# Altium project Chip_Tester.PrjPcb
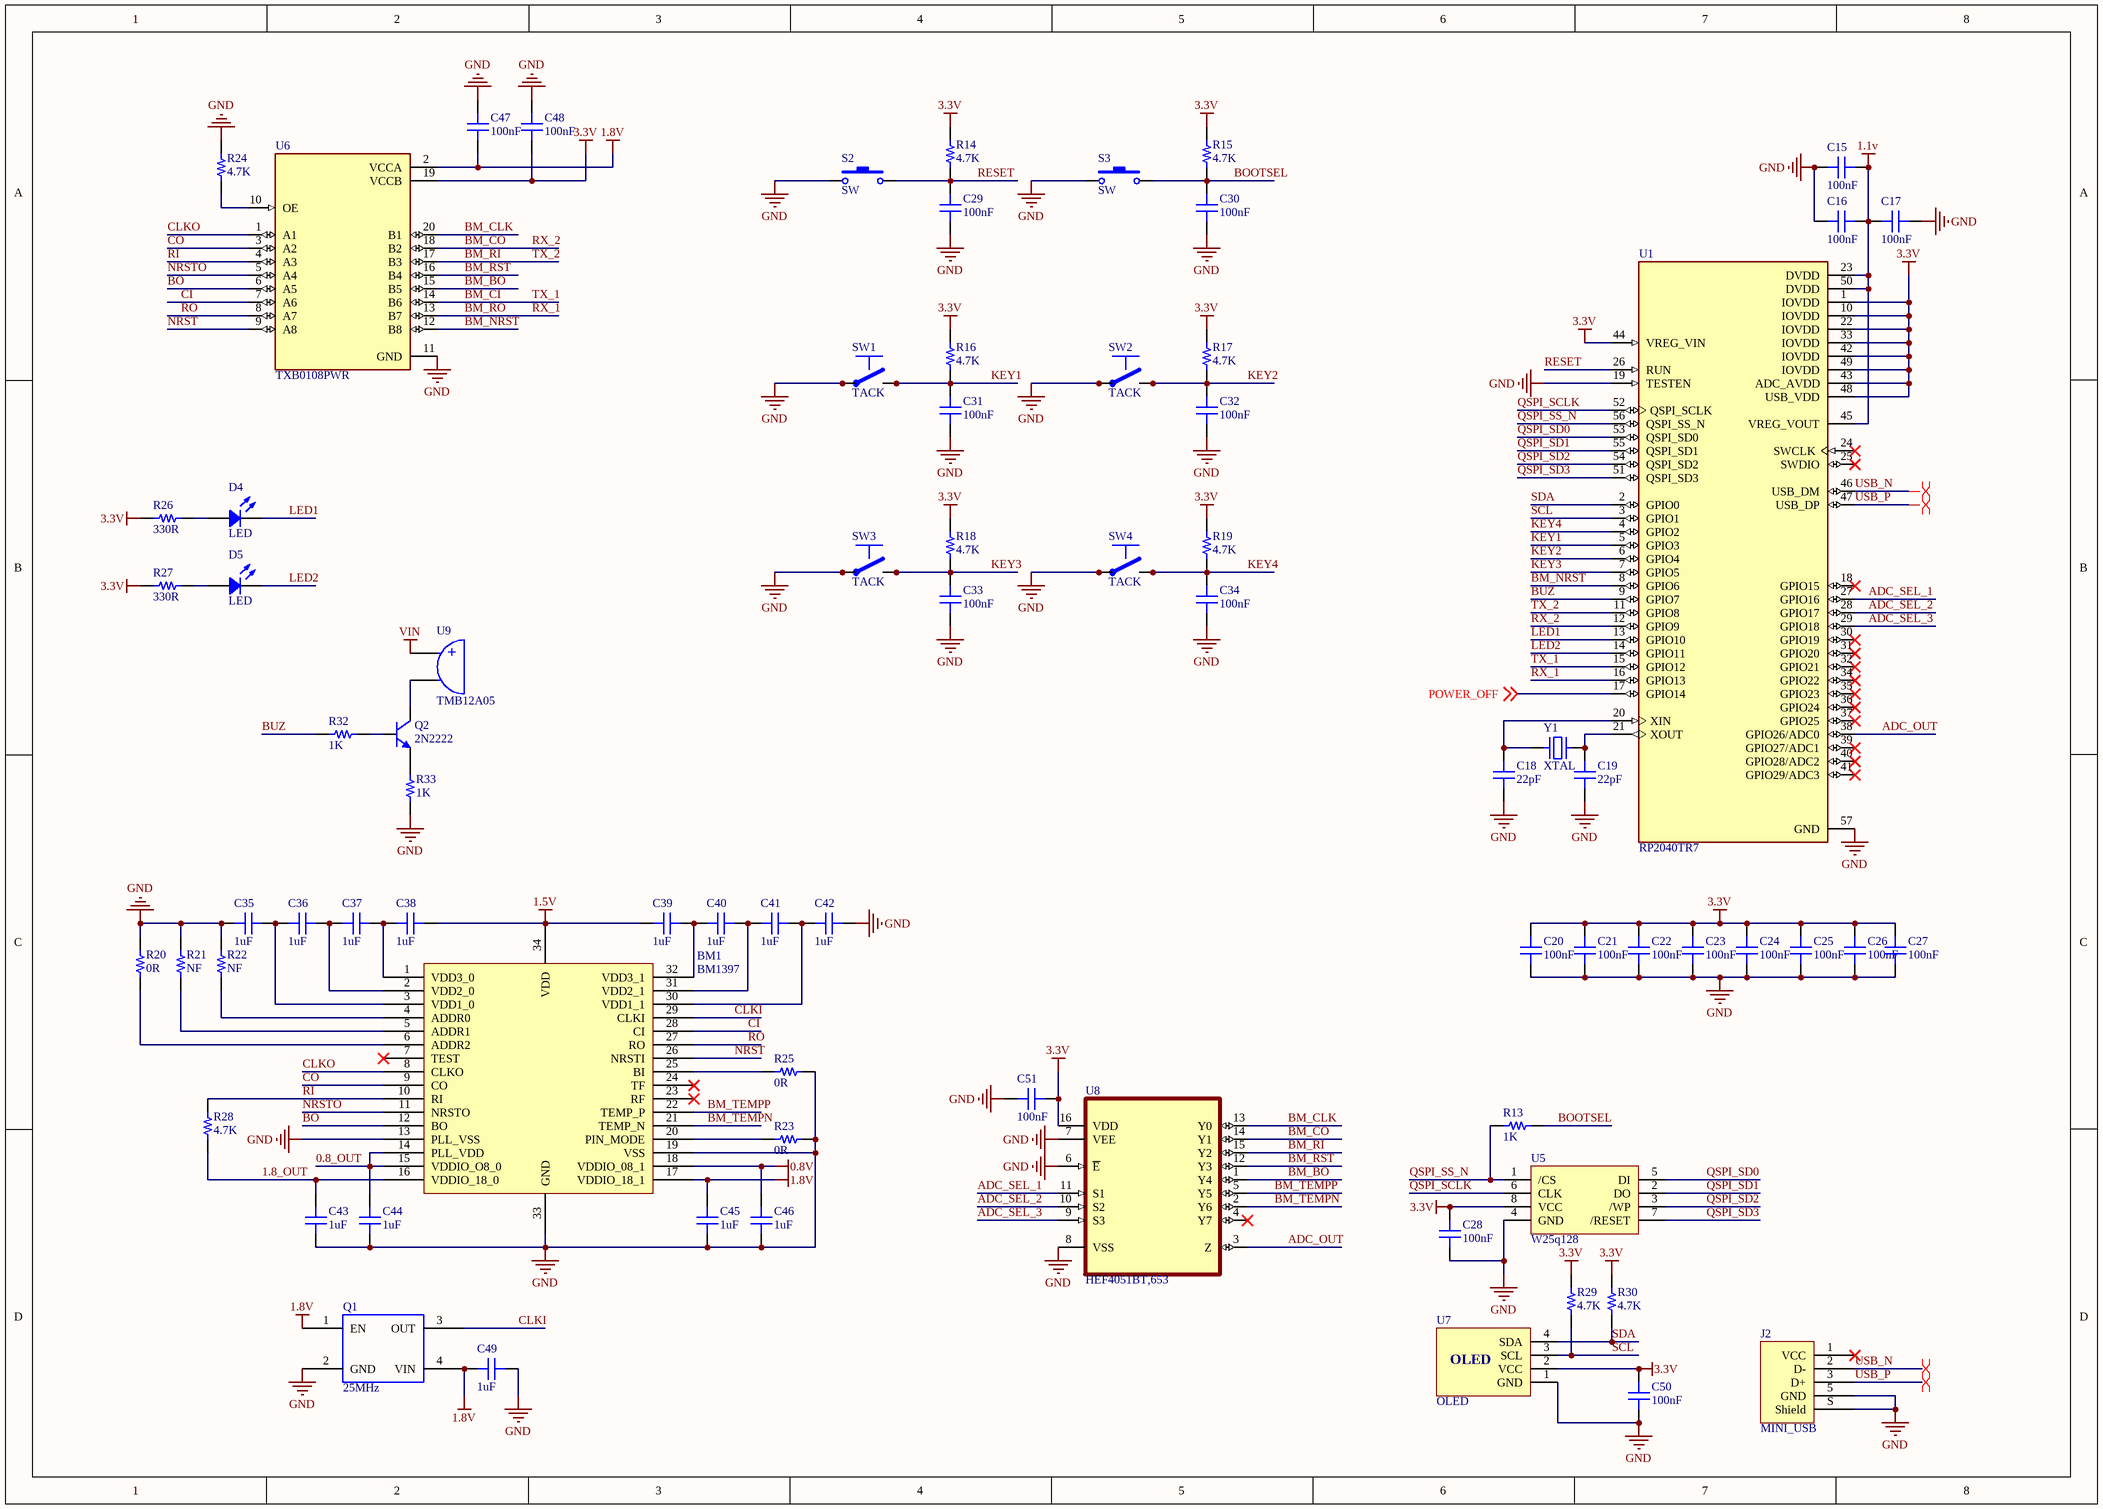
[diagram p0: Chip_Tester.SchDoc]
2 sheets, 114 parts. Net scope: global (net labels, ports and power ports of the same name join across sheets).
Board file: Chip_Tester.PcbDoc
Sheets:
  Chip_Tester.SchDoc
  Power.SchDoc

## Sheet Chip_Tester.SchDoc
size A3; SheetNumber: 1; SheetTotal: 2

### Parts
BM1  BM1397  [AllSocket]
C15  100nF  [CAP_SMD_0805]
C16  100nF  [CAP_SMD_0805]
C17  100nF  [CAP_SMD_0805]
C18  22pF  [CAP_SMD_0805]
C19  22pF  [CAP_SMD_0805]
C20  100nF  [CAP_SMD_0805]
C21  100nF  [CAP_SMD_0805]
C22  100nF  [CAP_SMD_0805]
C23  100nF  [CAP_SMD_0805]
C24  100nF  [CAP_SMD_0805]
C25  100nF  [CAP_SMD_0805]
C26  100nF  [CAP_SMD_0805]
C27  100nF  [CAP_SMD_0805]
C28  100nF  [CAP_SMD_0805]
C29  100nF  [CAP_SMD_0805]
C30  100nF  [CAP_SMD_0805]
C31  100nF  [CAP_SMD_0805]
C32  100nF  [CAP_SMD_0805]
C33  100nF  [CAP_SMD_0805]
C34  100nF  [CAP_SMD_0805]
C35  1uF  [CAP_SMD_0805]
C36  1uF  [CAP_SMD_0805]
C37  1uF  [CAP_SMD_0805]
C38  1uF  [CAP_SMD_0805]
C39  1uF  [CAP_SMD_0805]
C40  1uF  [CAP_SMD_0805]
C41  1uF  [CAP_SMD_0805]
C42  1uF  [CAP_SMD_0805]
C43  1uF  [CAP_SMD_0805]
C44  1uF  [CAP_SMD_0805]
C45  1uF  [CAP_SMD_0805]
C46  1uF  [CAP_SMD_0805]
C47  100nF  [CAP_SMD_0805]
C48  100nF  [CAP_SMD_0805]
C49  1uF  [CAP_SMD_0805]
C50  100nF  [CAP_SMD_0805]
C51  100nF  [CAP_SMD_0805]
D4  LED  [LED_0805_RED]
D5  LED  [LED_0805_RED]
J2  MINI_USB  [Mini_usb]
Q1  25MHz  [XTALL]
Q2  2N2222  [SOT-23_H]
R13  1K  [RES-SMD-0805]
R14  4.7K  [RES-SMD-0805]
R15  4.7K  [RES-SMD-0805]
R16  4.7K  [RES-SMD-0805]
R17  4.7K  [RES-SMD-0805]
R18  4.7K  [RES-SMD-0805]
R19  4.7K  [RES-SMD-0805]
R20  0R  [RES-SMD-0805]
R21  NF  [RES-SMD-0805]
R22  NF  [RES-SMD-0805]
R23  0R  [RES-SMD-0805]
R24  4.7K  [RES-SMD-0805]
R25  0R  [RES-SMD-0805]
R26  330R  [RES-SMD-0805]
R27  330R  [RES-SMD-0805]
R28  4.7K  [RES-SMD-0805]
R29  4.7K  [RES-SMD-0805]
R30  4.7K  [RES-SMD-0805]
R32  1K  [RES-SMD-0805]
R33  1K  [RES-SMD-0805]
S2  SW  [SW_PB_SMD_2PIN_SPST_6X3X5]
S3  SW  [SW_PB_SMD_2PIN_SPST_6X3X5]
SW1  TACK  [TACK]
SW2  TACK  [TACK]
SW3  TACK  [TACK]
SW4  TACK  [TACK]
U1  RP2040TR7  [RP2040-57N]
U5  W25q128  [WINBOND SOIC-8]
U6  TXB0108PWR  [SOP65P640X120-20N]
U7  OLED  [OLED]
U8  HEF4051BT,653  [SOIC127P600X175-16N]
U9  TMB12A05  [BUZZER_TMB12A05]
Y1  XTAL  [XTAL_SMD]

### Nets
0.8V: BM1.18(VDDIO_08_1) C46.2
1.1v: C15.2 C16.2 C17.1 U1.23(DVDD) U1.45(VREG_VOUT) U1.50(DVDD)
1.5V: BM1.34(VDD) C38.2 C39.1
1.8V: BM1.17(VDDIO_18_1) C45.2 C47.1 C49.2 Q1.1(EN) Q1.4(VIN) U6.2(VCCA)
3.3V: C20.1 C21.1 C22.1 C23.1 C24.1 C25.1 C26.1 C27.1 C28.1 C48.1 C50.2 C51.2 R14.2 R15.2 R16.2 R17.2 R18.2 R19.2 R26.2 R27.2 R29.2 R30.2 U1.1(IOVDD) U1.10(IOVDD) U1.22(IOVDD) U1.33(IOVDD) U1.42(IOVDD) U1.43(ADC_AVDD) U1.44(VREG_VIN) U1.48(USB_VDD) U1.49(IOVDD) U5.8(VCC) U6.19(VCCB) U7.2(VCC) U8.16(VDD)
GND: BM1.13(PLL_VSS) BM1.19(VSS) BM1.33(GND) C15.1 C16.1 C17.2 C18.2 C19.2 C20.2 C21.2 C22.2 C23.2 C24.2 C25.2 C26.2 C27.2 C28.2 C29.1 C30.1 C31.1 C32.1 C33.1 C34.1 C35.1 C42.2 C43.1 C44.1 C45.1 C46.1 C47.2 C48.2 C49.1 C50.1 C51.1 J2.5(GND) J2.S(Shield) Q1.2(GND) R20.2 R21.2 R22.2 R23.1 R24.2 R25.1 R33.2 S2.1 S3.1 SW1.1 SW1.2 SW2.1 SW2.2 SW3.1 SW3.2 SW4.1 SW4.2 U1.19(TESTEN) U1.57(GND) U5.4(GND) U6.11(GND) U7.1(GND) U8.6(~{E}) U8.7(VEE) U8.8(VSS)
VIN: U9.1
0.8_OUT: BM1.14(PLL_VDD) BM1.15(VDDIO_O8_0) C44.2
1.8_OUT: BM1.16(VDDIO_18_0) C43.2 R28.1
ADC_OUT: U1.38(GPIO26/ADC0) U8.3(Z)
ADC_SEL_1: U1.27(GPIO16) U8.11(S1)
ADC_SEL_2: U1.28(GPIO17) U8.10(S2)
ADC_SEL_3: U1.29(GPIO18) U8.9(S3)
BM_BO: U6.15(B5) U8.1(Y4)
BM_CI: U1.15(GPIO12) U6.14(B6)  [also labelled TX_1]
BM_CLK: U6.20(B1) U8.13(Y0)
BM_CO: U1.12(GPIO9) U6.18(B2) U8.14(Y1)  [also labelled RX_2]
BM_NRST: U1.8(GPIO6) U6.12(B8)
BM_RI: U1.11(GPIO8) U6.17(B3) U8.15(Y2)  [also labelled TX_2]
BM_RO: U1.16(GPIO13) U6.13(B7)  [also labelled RX_1]
BM_RST: U6.16(B4) U8.12(Y3)
BM_TEMPN: BM1.21(TEMP_N) U8.2(Y6)
BM_TEMPP: BM1.22(TEMP_P) U8.5(Y5)
BO: BM1.12(BO) U6.6(A5)
BOOTSEL: C30.2 R13.2 R15.1 S3.2
BUZ: R32.1 U1.9(GPIO7)
CI: BM1.28(CI) U6.7(A6)
CLKI: BM1.29(CLKI) Q1.3(OUT)
CLKO: BM1.8(CLKO) U6.1(A1)
CO: BM1.9(CO) U6.3(A2)
KEY1: C31.2 R16.1 SW1.3 SW1.4 U1.5(GPIO3)
KEY2: C32.2 R17.1 SW2.3 SW2.4 U1.6(GPIO4)
KEY3: C33.2 R18.1 SW3.3 SW3.4 U1.7(GPIO5)
KEY4: C34.2 R19.1 SW4.3 SW4.4 U1.4(GPIO2)
LED1: D4.2 U1.13(GPIO10)
LED2: D5.2 U1.14(GPIO11)
NRST: BM1.26(NRSTI) U6.9(A8)
NRSTO: BM1.11(NRSTO) U6.5(A4)
POWER_OFF: U1.17(GPIO14) ; off-sheet POWER_OFF
QSPI_SCLK: U1.52(QSPI_SCLK) U5.6(CLK)
QSPI_SD0: U1.53(QSPI_SD0) U5.5(DI)
QSPI_SD1: U1.55(QSPI_SD1) U5.2(DO)
QSPI_SD2: U1.54(QSPI_SD2) U5.3(/WP)
QSPI_SD3: U1.51(QSPI_SD3) U5.7(/RESET)
QSPI_SS_N: R13.1 U1.56(QSPI_SS_N) U5.1(/CS)
RESET: C29.2 R14.1 S2.2 U1.26(RUN)
RI: BM1.10(RI) R28.2 U6.4(A3)
RO: BM1.27(RO) U6.8(A7)
SCL: R29.1 U1.3(GPIO1) U7.3(SCL)
SDA: R30.1 U1.2(GPIO0) U7.4(SDA)
USB_N: J2.2(D-) U1.46(USB_DM)
USB_P: J2.3(D+) U1.47(USB_DP)
NetBM1_1: BM1.1(VDD3_0) C37.2 C38.1
NetBM1_2: BM1.2(VDD2_0) C36.2 C37.1
NetBM1_3: BM1.3(VDD1_0) C35.2 C36.1
NetBM1_4: BM1.4(ADDR0) R22.1
NetBM1_5: BM1.5(ADDR1) R21.1
NetBM1_6: BM1.6(ADDR2) R20.1
NetBM1_20: BM1.20(PIN_MODE) R23.2
NetBM1_25: BM1.25(BI) R25.2
NetBM1_30: BM1.30(VDD1_1) C41.2 C42.1
NetBM1_31: BM1.31(VDD2_1) C40.2 C41.1
NetBM1_32: BM1.32(VDD3_1) C39.2 C40.1
NetC18_1: C18.1 U1.20(XIN) Y1.1
NetC19_1: C19.1 U1.21(XOUT) Y1.2
NetD4_1: D4.1 R26.1
NetD5_1: D5.1 R27.1
NetQ2_1: Q2.1(B) R32.2
NetQ2_2: Q2.2(E) R33.1
NetQ2_3: Q2.3(C) U9.2
NetR24_1: R24.1 U6.10(OE)

Not connected (* = marked no-connect by the designer): BM1 7(TEST)* 23(RF)* 24(TF)*; J2 1(VCC)*; U1 18(GPIO15)* 24(SWCLK)* 25(SWDIO)* 30(GPIO19)* 31(GPIO20)* 32(GPIO21)* 34(GPIO22)* 35(GPIO23)* 36(GPIO24)* 37(GPIO25)* 39(GPIO27/ADC1)* 40(GPIO28/ADC2)* 41(GPIO29/ADC3)*; U8 4(Y7)*

### Layout directives
differential pair: USB_N, USB_P

### Notes on the sheet
- (in symbol Buzzer_TMB12A05) +

### Library data of the parts
BM1 = BM1397_0
C15-C51 = CAP
Q1 = OSCILLATOR
Q2 = MMBT2222ALT1G: NPN General Purpose Amplifier; Manufacturer: FAIRCHILD; Link to Datasheet: *; Link to Picture: *; Operating Temp: -55 TO 150 °C; Storage Temp: -55 TO 150 °C; ComponentLink1URL: *; ComponentLink1Description: *; Manufacture Part #: MMBT2222ALT1G; Value: 2N2222
R13-R30 R32 R33 = RES
S2 S3 = SW-PB-2Pin-SMD: SMT Tactile ‎Switch
SW1-SW4 = SW
U1 = RP2040TR7: MCU, 32BIT, 133MHZ, QFN-56; Product Range:-; Architecture:ARM Cortex-M0+; No. of Bits:32bit; CPU Speed:133MHz; Program Memory Size:16MB; RAM Memory Size:264KB; No. of Pins:56Pins; MCU Case Style:QFN; No. of I/O s:30I/O s; MF: Raspberry Pi; SnapEDA_Link: https://www.snapeda.com/parts/RP2040TR7/Raspberry+Pi/view-part/?ref=snap; Value: *; MP: RP2040TR7; Availability: In Stock; Check_prices: https://www.snapeda.com/parts/RP2040TR7/Raspberry+Pi/view-part/?ref=eda; Package: None; Price: None
U6 = TXB0108PWR: 8-Bit Bidirectional Voltage-Level Shifter with Auto Direction Sensing and +/-15-kV ESD Protect; MF: Texas Instruments; SnapEDA_Link: https://www.snapeda.com/parts/TXB0108PWR/Texas+Instruments/view-part/?ref=snap; Package: TSSOP-20 Texas Instruments; MP: TXB0108PWR; Check_prices: https://www.snapeda.com/parts/TXB0108PWR/Texas+Instruments/view-part/?ref=eda; Purchase-URL: https://pricing.snapeda.com/search/part/TXB0108PWR/?ref=eda; Digi-Key_Part_Number: 296-21527-2-ND; Value: *
U8 = HEF4051BT,653: 4000B Series 3 - 15 V 8-Ch Analog Multiplexer/Demultiplexer - SOIC-16; MF: Nexperia USA; Value: *; Purchase-URL: https://pricing.snapeda.com/search/part/HEF4051BT,653/?ref=eda; Price: None; MP: HEF4051BT,653; SnapEDA_Link: https://www.snapeda.com/parts/HEF4051BT,653/Nexperia/view-part/462214/?ref=snap; Check_prices: https://www.snapeda.com/parts/HEF4051BT,653/Nexperia/view-part/462214/?ref=eda; Availability: In Stock; Package: SO-16 Nexperia USA Inc.
U9 = Buzzer_TMB12A05: Integrated Buzzer; Link to Datasheet: *; Link to Picture: *; Manufacturer: http://www.ehuaxing.com/; Operating Temp: -30°C ~ 75°C; Storage Temp: -40°C ~ 85°C; ComponentLink1URL: *; ComponentLink1Description: *; Manufacture Part #: TMB12A05; Value: TMB12A05
Y1 = XTAL: Crystal 8MHz ±50ppm (Tol) ±50ppm (Stability) 20pF FUND 40Ohm 2-Pin HC-49 Thru-Hole Loose; Manufacturer: IQD; Manufacturer Part Number: LFXTAL078428BULK; Supplier 1: Digi-Key; RoHS: No; Stock 1: 784; Pricing 1: 1=0.50000, 10=0.42000, 50=0.37800, 100=0.33600, 500=0.31920, 1000=0.26880, 2500=0.25200, 5000=0.24360, 10000=0.23520 (USD); Supplier Part Number 1: 1923-1403-ND

## Sheet Power.SchDoc
size A4; SheetNumber: 2; SheetTotal: 2
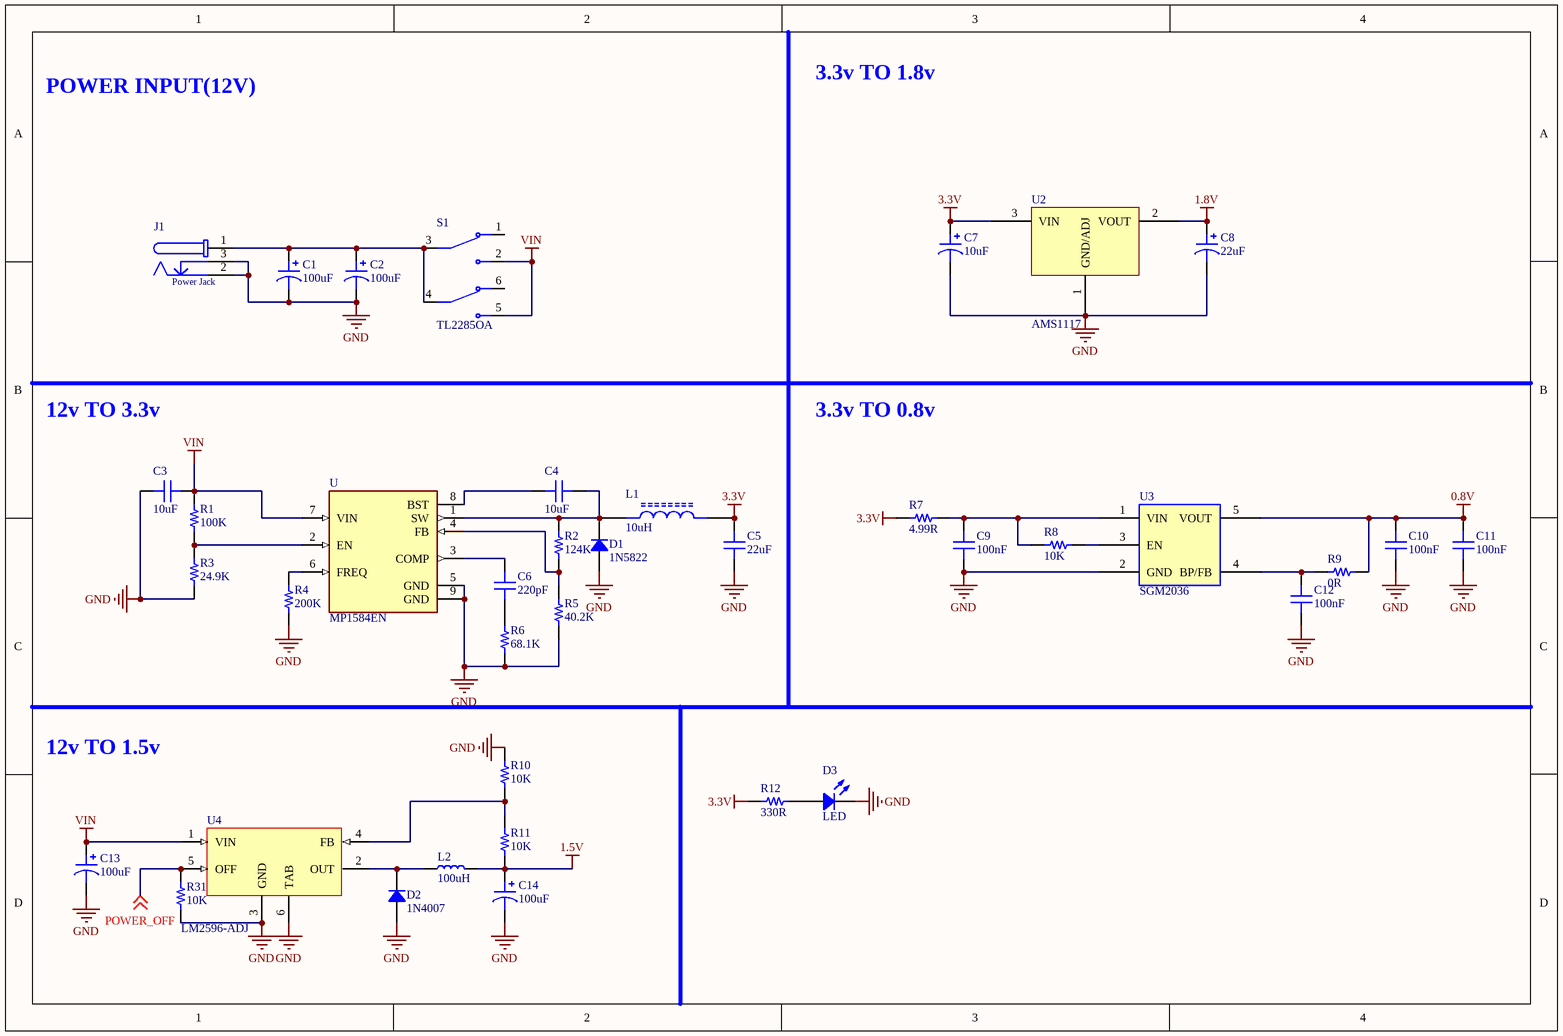
[diagram p1: Power.SchDoc]

### Parts
C1  100uF  [CAP ALUM 10.3MM]
C2  100uF  [CAP ALUM 10.3MM]
C3  10uF  [CAP-SMD-1206]
C4  10uF  [CAP-SMD-1206]
C5  22uF  [CAP-SMD-1206]
C6  220pF  [CAP-SMD-1206]
C7  10uF  [CAP-TAN-CASE-A]
C8  22uF  [CAP-TAN-CASE-A]
C9  100nF  [CAP-SMD-1206]
C10  100nF  [CAP-SMD-1206]
C11  100nF  [CAP-SMD-1206]
C12  100nF  [CAP-SMD-1206]
C13  100uF  [CAP-TAN-CASE-E]
C14  100uF  [CAP-TAN-CASE-E]
D1  1N5822  [m7]
D2  1N4007  [m7]
D3  LED  [LED_0805_RED]
J1  Power Jack  [DC-Jack-THT-RA-6.4]
L1  10uH  [SRN6045TA]
L2  100uH  [inductor]
R1  100K  [RES-SMD-0805]
R2  124K  [RES-SMD-0805]
R3  24.9K  [RES-SMD-0805]
R4  200K  [RES-SMD-0805]
R5  40.2K  [RES-SMD-0805]
R6  68.1K  [RES-SMD-0805]
R7  4.99R  [RES-SMD-0805]
R8  10K  [RES-SMD-0805]
R9  0R  [RES-SMD-0805]
R10  10K  [RES-SMD-0805]
R11  10K  [RES-SMD-0805]
R12  330R  [RES-SMD-0805]
R31  10K  [RES-SMD-0805]
S1  TL2285OA  [SW_TL2285OA]
U  MP1584EN  [SOIC127P600X170-9N]
U2  AMS1117  [AMS1117]
U3  SGM2036  [SOT23-5PIN]
U4  LM2596-ADJ  [LM2576]

### Nets
0.8V: C10.2 C11.2 R9.1 U3.5(VOUT)
1.5V: C14.1 L2.2 R11.2
1.8V: C8.1 U2.2(VOUT)
3.3V: C5.2 C7.1 L1.2 R7.2 R12.2 U2.3(VIN)
GND: C1.2 C2.2 C3.1 C5.1 C7.2 C8.2 C9.1 C10.1 C11.1 C12.1 C13.2 C14.2 D1.1 D2.1 D3.2 J1.2 J1.3 R3.1 R4.1 R5.1 R6.1 R10.1 R31.2 U.5(GND) U.9(GND) U2.1(GND/ADJ) U3.2(GND) U4.3(GND) U4.6(TAB)
VIN: C3.2 C13.1 R1.2 S1.2(NO1) S1.5(NO2) U.7(VIN) U4.1(VIN)
POWER_OFF: R31.1 U4.5(OFF) ; off-sheet POWER_OFF
NetC1_1: C1.1 C2.1 J1.1 S1.3(COM1) S1.4(COM2)
NetC4_1: C4.1 U.8(BST)
NetC4_2: C4.2 D1.2 L1.1 R2.2 U.1(SW)
NetC6_1: C6.1 R6.2
NetC6_2: C6.2 U.3(COMP)
NetC9_2: C9.2 R7.1 R8.2 U3.1(VIN)
NetC12_2: C12.2 R9.2 U3.4(BP/FB)
NetD2_2: D2.2 L2.1 U4.2(OUT)
NetD3_1: D3.1 R12.1
NetR1_1: R1.1 R3.2 U.2(EN)
NetR2_1: R2.1 R5.2 U.4(FB)
NetR4_2: R4.2 U.6(FREQ)
NetR8_1: R8.1 U3.3(EN)
NetR10_2: R10.2 R11.1 U4.4(FB)

Not connected (* = marked no-connect by the designer): S1 1(NC1) 6(NC2)

### Notes on the sheet
- POWER INPUT(12V)
- 3.3v TO 1.8v
- 12v TO 3.3v
- 3.3v TO 0.8v
- 12v TO 1.5v

### Library data of the parts
C1 C2 C7 C8 C13 C14 = POLARIZED CAP
C3-C6 C9-C12 = CAP
D1 = 1N4007
J1 = DC-JACK: DC Power Jack Connector Low Profile with 4 soldering pads; Gender: Male; Plug Inner Diameter: 1.05 mm; Plug Outer Diameter: 3.5 mm; Rated Current: 5 A; Working Voltage: 18 V; Orientation: Right Angled; Operating Temperature: -40 to 85 degC; Mounting Technology: SMT
L1 = SRN6045TA-3R3Y: 3.3µH Semi-Shielded Wirewound Inductor 5A 21mOhm Nonstandard
L2 = inductor
R1-R12 R31 = RES
S1 = TL2285OA: Pushbutton Switch DPDT Standard Through Hole; MF: E-Switch; Package: None; Availability: In Stock; Check_prices: https://www.snapeda.com/parts/TL2285OA/E-Switch/view-part/?ref=eda; Purchase-URL: https://pricing.snapeda.com/search/part/TL2285OA/?ref=eda; Value: *; MP: TL2285OA; SnapEDA_Link: https://www.snapeda.com/parts/TL2285OA/E-Switch/view-part/?ref=snap; Price: None
U = MP1584EN: Buck Switching Regulator IC Positive Adjustable 0.8V 1 Output 3A 8-SOIC _0.154, 3.90mm Width_ Exposed Pad; MF: Monolithic Power; MP: MP1584EN; Value: *; Package: SOIC-8 Monolithic Power; SnapEDA_Link: https://www.snapeda.com/parts/MP1584EN/Monolithic%20Power%20Systems%20Inc./view-part/891721/?ref=snap; Price: None; Availability: Unavailable
U2 = AMS1117: AMS1117 1A LOW DROPOUT VOLTAGE REGULATOR
U4 = LM2576S-5.0: SIMPLE SWITCHER® 40V, 3A Low Component Count Step-Down Regulator 5-DDPAK/TO-263 -40 to 125; Manufacturer: TI National Semiconductor; Manufacturer Part Number: LM2576S-5.0/NOPB; Min Supply Voltage: 4V; Number of Outputs: 1; Output Voltage: 5V; Frequency: 52kHz; Switching Frequency: 58kHz; Efficiency: 77%; Quiescent Current: 5mA; Output Type: Fixed; Supplier 1: Digi-Key; RoHS: Yes; Category: Voltage Regulators - Switching; Stock 1: 747; Pricing 1: 1=4.79000, 10=4.30600, 25=4.07120, 100=3.52840, 250=3.34744, 500=3.00364, 1000=2.98725 (USD); Mount: Surface Mount; Case/Package: TO-263; Number of Pins: 5; Weight: 0.25lb; Contact Plating: Tin,Matte; Min Operating Temperature: -40°C; Max Operating Temperature: 125°C; Max Supply Voltage: 40V; Max Output Current: 3A; Packaging: Rail/Tube; Min Input Voltage: 4V; Max Input Voltage: 40V; Output Current: 3A; Package Quantity: 45; Nominal Output Voltage: 5V; Max Output Voltage: 5V; Termination: SMD/SMT; Series: LM2576; Length: 10.16mm; Width: 8.64mm; Height: 4.57mm; Radiation Hardening: No; REACH SVHC: No SVHC; Lead Free: Contains Lead; RoHS Compliant: Yes; ComponentLink1URL: https://datasheet.ciiva.com/27050/894690-27050690.pdf?src-supplier=Jameco; ComponentLink1Description: https://datasheet.ciiva.com/27050/894690-27050690.pdf?src-supplier=Jameco; ComponentLink2URL: https://datasheet.ciiva.com/15112/getdatasheetpartid-89880-15112831.pdf?src-supplier=Verical; ComponentLink2Description: https://datasheet.ciiva.com/15112/getdatasheetpartid-89880-15112831.pdf?src-supplier=Verical; ComponentLink3URL: https://datasheet.ciiva.com/6596/lm2576hv-6596629.pdf?src-supplier=Digi-Key; ComponentLink3Description: https://datasheet.ciiva.com/6596/lm2576hv-6596629.pdf?src-supplier=Digi-Key; ComponentLink4URL: https://datasheet.ciiva.com/16466/lm2576-16466309.pdf?src-supplier=Avnet+Asia; ComponentLink4Description: https://datasheet.ciiva.com/16466/lm2576-16466309.pdf?src-supplier=Avnet+Asia; ComponentLink5URL: https://datasheet.ciiva.com/7994/1849802-7994190.pdf?src-supplier=Element14; ComponentLink5Description: https://datasheet.ciiva.com/7994/1849802-7994190.pdf?src-supplier=Element14; Supplier Part Number 1: LM2576S-5.0/NOPB-ND

## Nets that join several sheets
0.8V: Chip_Tester (BM1.18 C46.2), Power (C10.2 C11.2 R9.1 U3.5)
1.5V: Chip_Tester (BM1.34 C38.2 C39.1), Power (C14.1 L2.2 R11.2)
1.8V: Chip_Tester (7 pins), Power (C8.1 U2.2)
3.3V: Chip_Tester (35 pins), Power (6 pins)
GND: Chip_Tester (62 pins), Power (29 pins)
VIN: Chip_Tester (U9.1), Power (7 pins)
POWER_OFF: Chip_Tester (U1.17), Power (R31.1 U4.5)